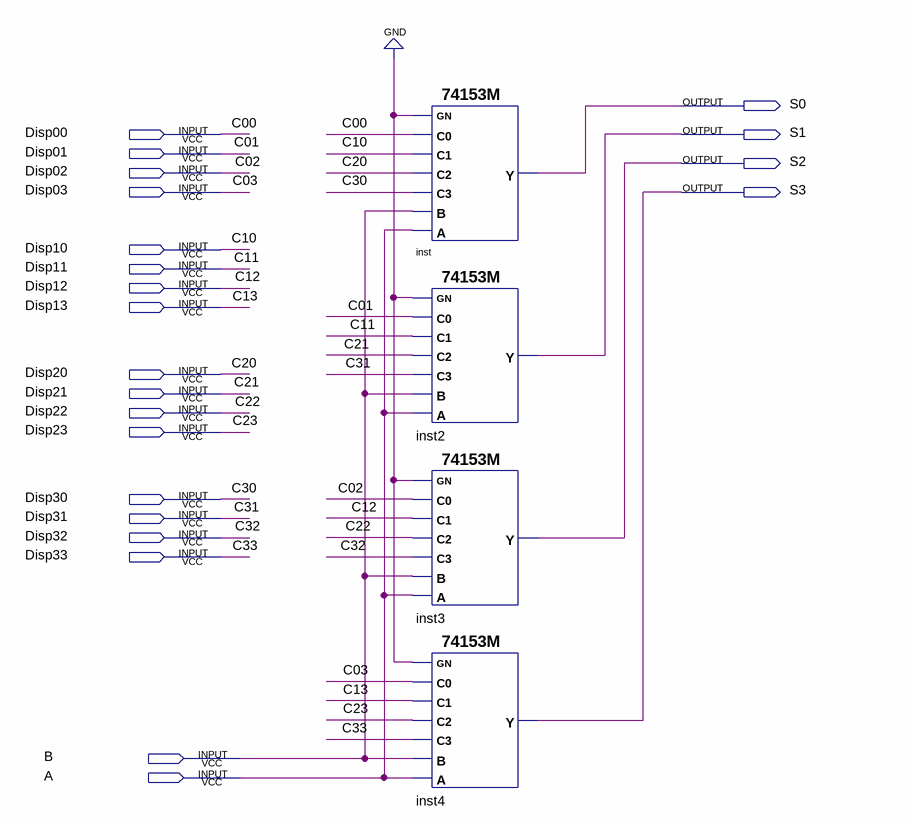
[diagram p0: schematic sheet]
// Quartus schematic Multiplexador.bdf as structural Verilog: 4 symbols, 22 pins
module Multiplexador (
  input  Disp00,
  input  Disp01,
  input  Disp02,
  input  Disp03,
  input  Disp10,
  input  Disp11,
  input  Disp12,
  input  Disp13,
  input  Disp20,
  input  Disp21,
  input  Disp22,
  input  Disp23,
  input  Disp30,
  input  Disp31,
  input  Disp32,
  input  Disp33,
  input  B,
  input  A,
  output S0,
  output S1,
  output S2,
  output S3
);

  \74153M  inst (.A(A), .B(B), .C3(Disp30), .C2(Disp20), .C1(Disp10), .C0(Disp00), .GN(1'b0), .Y(S0));
  \74153M  inst2 (.A(A), .B(B), .C3(Disp31), .C2(Disp21), .C1(Disp11), .C0(Disp01), .GN(1'b0), .Y(S1));
  \74153M  inst3 (.A(A), .B(B), .C3(Disp32), .C2(Disp22), .C1(Disp12), .C0(Disp02), .GN(1'b0), .Y(S2));
  \74153M  inst4 (.A(A), .B(B), .C3(Disp33), .C2(Disp23), .C1(Disp13), .C0(Disp03), .GN(1'b0), .Y(S3));

  // Other names for the same wires on the sheet: C00 = Disp00; C01 = Disp01; C02 = Disp02; C03 = Disp03; C10 = Disp10;
  //   C11 = Disp11; C12 = Disp12; C13 = Disp13; C20 = Disp20; C21 = Disp21; C22 = Disp22; C23 = Disp23; C30 = Disp30;
  //   C31 = Disp31; C32 = Disp32; C33 = Disp33
endmodule
